# Altium schematic sheet TConsoleWindow.SchDoc: LiveDesign Evaluation - Countdown
size A3; Organization: Altium Limited; Address1: L3, 12a Rodborough Rd; Address2: Frenchs Forest; Address3: NSW; Address4: Australia 2086; DocumentNumber: 8; SheetNumber: 8; SheetTotal: 11
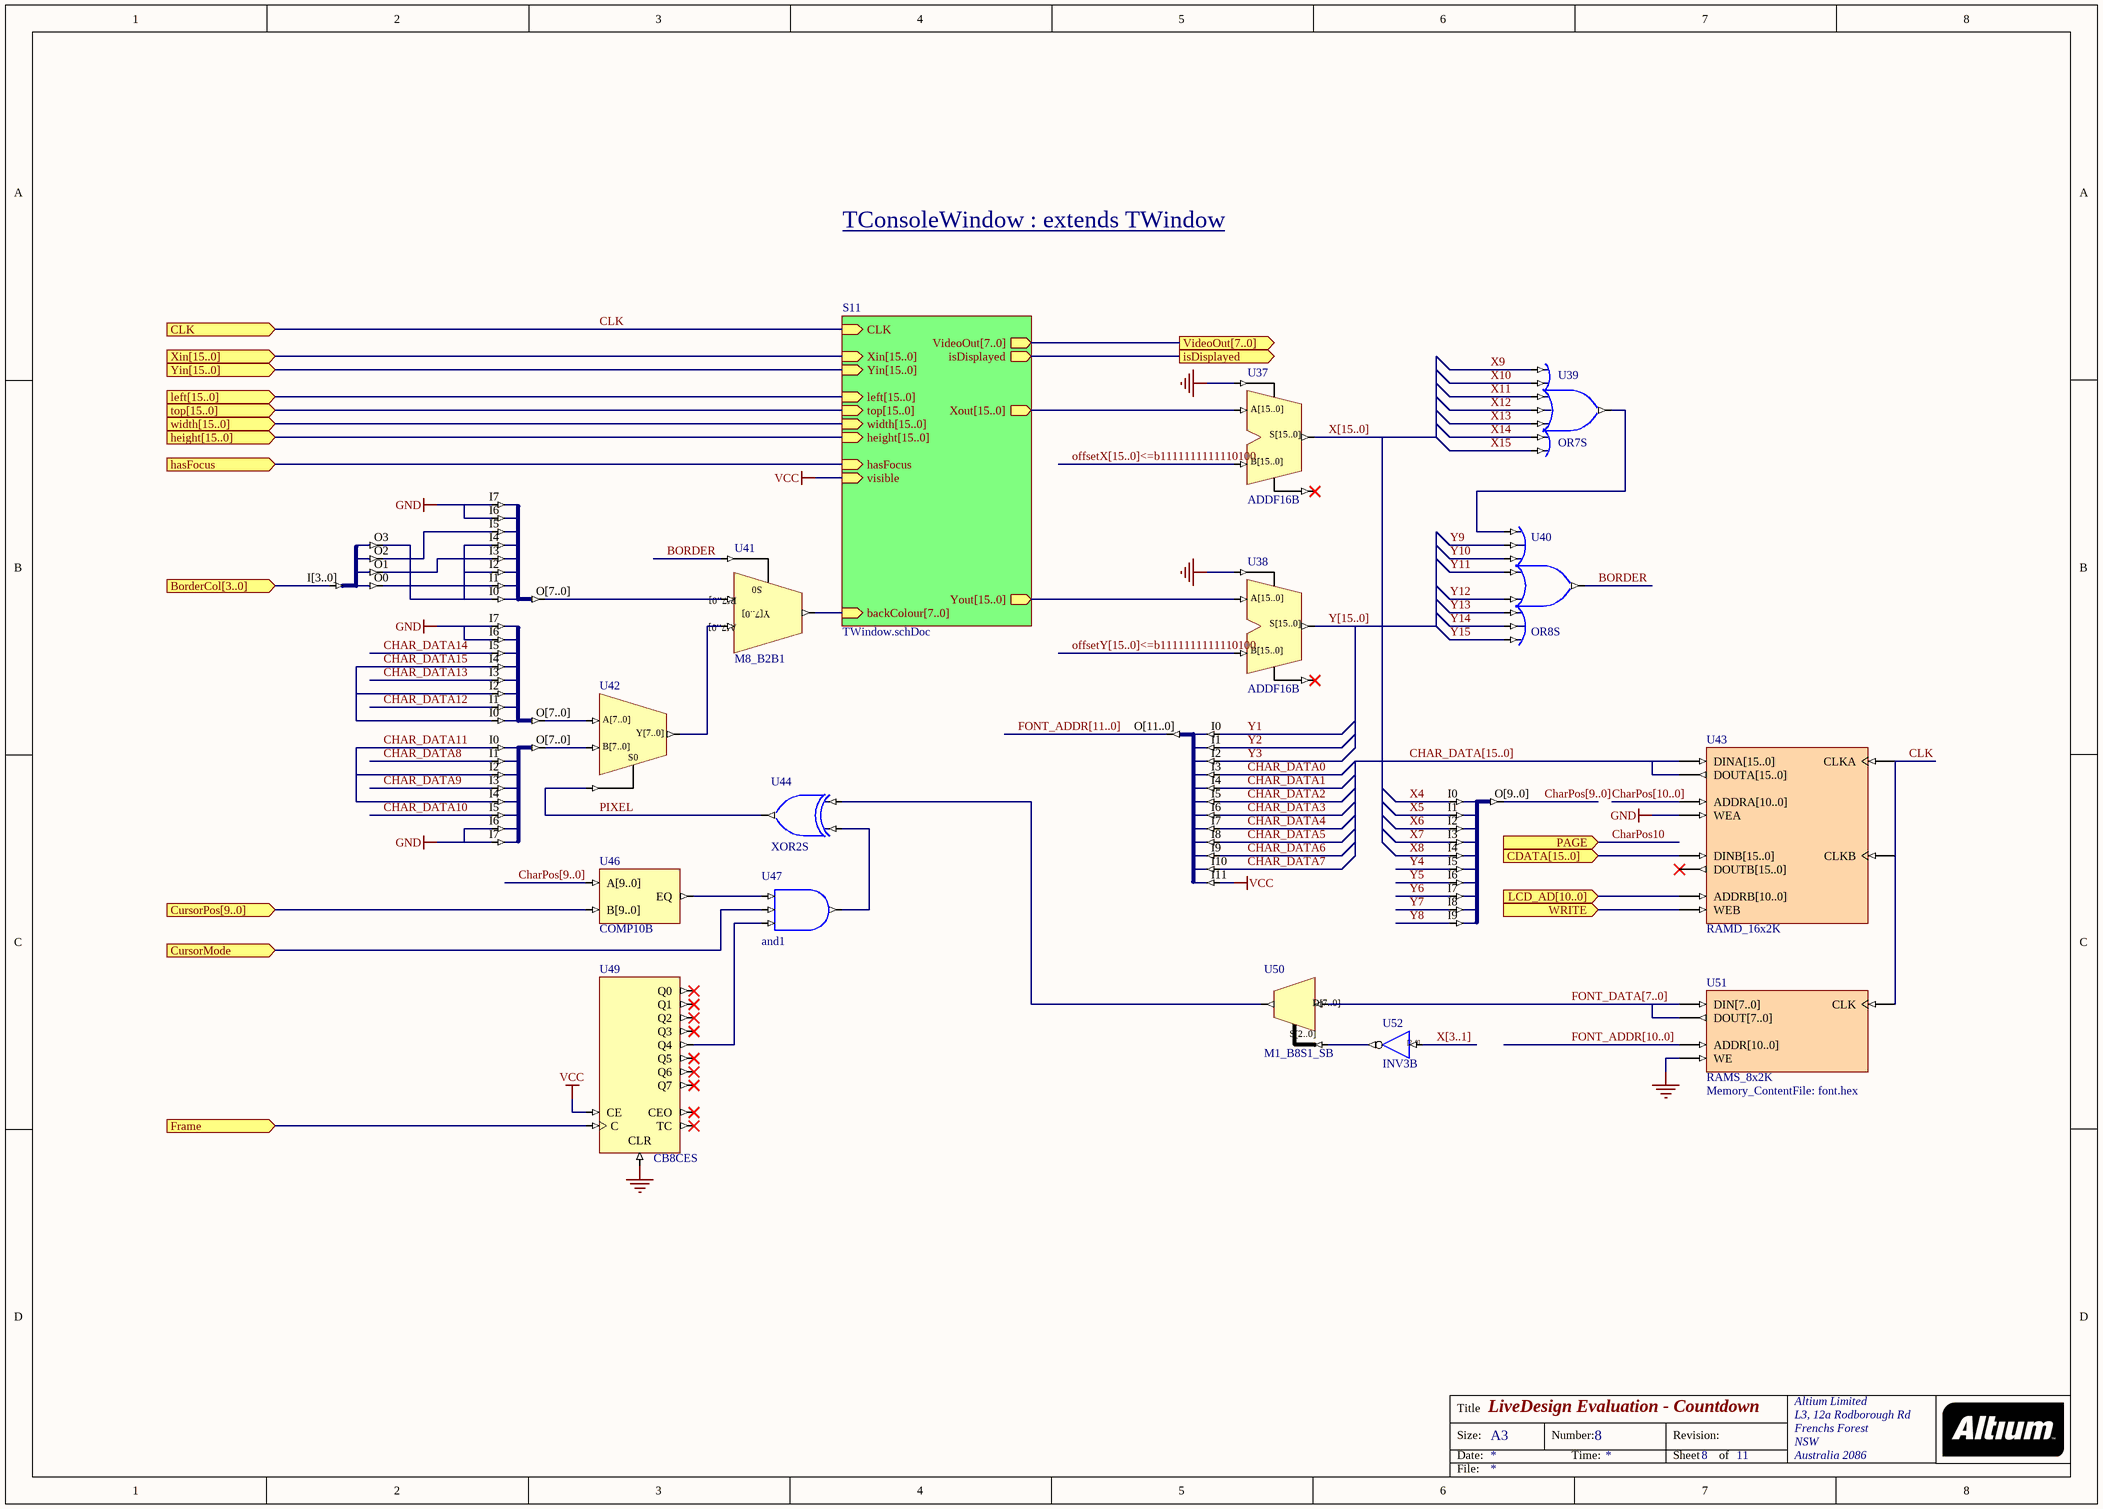
[diagram p0: TConsoleWindow.SchDoc]

## Parts
U33  J8S_8B  (value not drawn)
U34  J8S_8B  (value not drawn)
U35  J8S_8B  (value not drawn)
U36  J4B_4S  (value not drawn)
U37  ADDF16B
U38  ADDF16B
U39  OR7S
U40  OR8S
U41  M8_B2B1
U42  M8_B2B1  (value not drawn)
U43  RAMD_16x2K
U44  XOR2S
U45  J10S_10B  (value not drawn)
U46  COMP10B
U47  and1
U48  J12S_12B  (value not drawn)
U49  CB8CES
U50  M1_B8S1_SB
U51  RAMS_8x2K  Memory_ContentFile: font.hex
U52  INV3B

## Sub-sheets
S11 = TWindow.schDoc: CLK (in), VideoOut[7..0] (out), Xin[15..0] (in), Yin[15..0] (in), top[15..0] (in), width[15..0] (in), height[15..0] (in), left[15..0] (in), Xout[15..0] (out), Yout[15..0] (out), backColour[7..0] (in), isDisplayed (out), visible (in), hasFocus (in)

## Ports
BorderCol[3..0] (in), CDATA[15..0] (in), CLK (in), CursorMode (in), CursorPos[9..0] (in), Frame (in), hasFocus (in), height[15..0] (in), isDisplayed (out), LCD_AD[10..0] (in), left[15..0] (in), PAGE (in), top[15..0] (in), VideoOut[7..0] (out), width[15..0] (in), WRITE (in), Xin[15..0] (in), Yin[15..0] (in)

## Nets
GND: U33.I6 U33.I7 U34.I6 U34.I7 U35.I6 U35.I7 U37.CI U38.CI U43.WEA U49.CLR U51.WE
VCC: U48.I11 U49.CE ; sheet S11/visible
BORDER: U40.O U41.S0
BorderCol[3..0]: U36.I[3..0] ; port BorderCol[3..0]
CDATA[15..0]: U43.DINB[15..0] ; port CDATA[15..0]
CHAR_DATA0: U48.I3
CHAR_DATA1: U48.I4
CHAR_DATA2: U48.I5
CHAR_DATA3: U48.I6
CHAR_DATA4: U48.I7
CHAR_DATA5: U48.I8
CHAR_DATA6: U48.I9
CHAR_DATA7: U48.I10
CHAR_DATA8: U35.I1
CHAR_DATA9: U35.I3
CHAR_DATA10: U35.I5
CHAR_DATA11: U35.I0 U35.I2 U35.I4
CHAR_DATA12: U34.I1
CHAR_DATA13: U34.I3
CHAR_DATA14: U34.I5
CHAR_DATA15: U34.I0 U34.I2 U34.I4
CHAR_DATA[15..0]: U43.DINA[15..0] U43.DOUTA[15..0]
CharPos10: port PAGE
CharPos[9..0]: U45.O[9..0] U46.A[9..0]
CharPos[10..0]: U43.ADDRA[10..0]
CLK: U43.CLKA U43.CLKB U51.CLK ; port CLK, sheet S11/CLK
CursorMode: U47.I1 ; port CursorMode
CursorPos[9..0]: U46.B[9..0] ; port CursorPos[9..0]
FONT_ADDR[10..0]: U51.ADDR[10..0]
FONT_ADDR[11..0]: U48.O[11..0]
FONT_DATA[7..0]: U50.D[7..0] U51.DIN[7..0] U51.DOUT[7..0]
Frame: U49.C ; port Frame
hasFocus: port hasFocus, sheet S11/hasFocus
isDisplayed: port isDisplayed, sheet S11/isDisplayed
LCD_AD[10..0]: U43.ADDRB[10..0] ; port LCD_AD[10..0]
offsetX[15..0]<=b1111111111110100: U37.B[15..0]
offsetY[15..0]<=b1111111111110100: U38.B[15..0]
PIXEL: U42.S0 U44.O
WRITE: U43.WEB ; port WRITE
X4: U45.I0
X5: U45.I1
X6: U45.I2
X7: U45.I3
X8: U45.I4
X9: U39.I0
X10: U39.I1
X11: U39.I2
X12: U39.I3
X13: U39.I4
X14: U39.I5
X15: U39.I6
X[3..1]: U52.I[2..0]
X[15..0]: U37.S[15..0]
Y1: U48.I0
Y2: U48.I1
Y3: U48.I2
Y4: U45.I5
Y5: U45.I6
Y6: U45.I7
Y7: U45.I8
Y8: U45.I9
Y9: U40.I1
Y10: U40.I2
Y11: U40.I3
Y12: U40.I4
Y13: U40.I5
Y14: U40.I6
Y15: U40.I7
Y[15..0]: U38.S[15..0]
NetU33_I0: U33.I0 U33.I2 U33.I4 U36.O3
NetU33_I1: U33.I1 U36.O0
NetU33_I3: U33.I3 U36.O1
NetU33_I5: U33.I5 U36.O2
NetU33_O[7..0]: U33.O[7..0] U41.B[7..0]
NetU34_O[7..0]: U34.O[7..0] U42.A[7..0]
NetU35_O[7..0]: U35.O[7..0] U42.B[7..0]
NetU37_A[15..0]: U37.A[15..0] ; sheet S11/Xout[15..0]
NetU38_A[15..0]: U38.A[15..0] ; sheet S11/Yout[15..0]
NetU39_O: U39.O U40.I0
NetU41_A[7..0]: U41.A[7..0] U42.Y[7..0]
NetU41_Y[7..0]: U41.Y[7..0] ; sheet S11/backColour[7..0]
NetU44_I0: U44.I0 U50.O
NetU44_I1: U44.I1 U47.O
NetU46_EQ: U46.EQ U47.I0
NetU47_I2: U47.I2 U49.Q4
NetU50_S[2..0]: U50.S[2..0] U52.O[2..0]

Not connected (* = marked no-connect by the designer): U37 CO*; U38 CO*; U43 DOUTB[15..0]*; U49 CEO* Q0* Q1* Q2* Q3* Q5* Q6* Q7* TC*

## Buses and harness runs
bus CHAR_DATA[15..0]
bus CharPos[9..0]
bus CharPos[10..0]
bus FONT_ADDR[10..0]
bus FONT_ADDR[11..0]
bus FONT_DATA[7..0]
bus offsetX[15..0]<=b1111111111110100
bus offsetY[15..0]<=b1111111111110100
bus port height[15..0] = sheet S11/height[15..0]
bus port left[15..0] = sheet S11/left[15..0]
bus port top[15..0] = sheet S11/top[15..0]
bus port VideoOut[7..0] = sheet S11/VideoOut[7..0]
bus port width[15..0] = sheet S11/width[15..0]
bus port Xin[15..0] = sheet S11/Xin[15..0]
bus port Yin[15..0] = sheet S11/Yin[15..0]
bus X[3..1]
bus X[15..0]
bus Y[15..0]

## Notes on the sheet
- TConsoleWindow : extends TWindow
- Title
- Size:
- Date:
- A3
- Number:
- Time:
- Revision:
- Sheet
- of
- File:
- (in symbol INV3B) [2..0]

## Library data of the parts
U33-U35 = J8S_8B: 8 Single pin inputs to single 8-Bit output bus; ArchiveName: GENERIC; VHDLIB_SIM: GENERIC_LIB; Published: 29-Jan-2004; Publisher: Altium Limited; Core Revision: 1.00.00
U36 = J4B_4S: 4-Bit input bus to 4 Single pin outputs; ArchiveName: GENERIC; VHDLIB_SIM: GENERIC_LIB; Published: 29-Jan-2004; Publisher: Altium Limited; Core Revision: 1.00.00
U37 U38 = ADDF16B: 16-Bit Cascadable Unsigned Binary Full Adder, Bus Version; ArchiveName: GENERIC; VHDLIB_SIM: GENERIC_LIB; Published: 31-May-2004; Publisher: Altium Limited; Core Revision: 1.00.00
U39 = OR7S: 7-Input OR Gate, Single Pin Version; Xilinx Equivalent: OR7; ArchiveName: GENERIC; VHDLIB_SIM: GENERIC_LIB; Published: 29-Jan-2004; Publisher: Altium Limited; Core Revision: 1.00.00
U40 = OR8S: 8-Input OR Gate, Single Pin Version; ArchiveName: GENERIC; VHDLIB_SIM: GENERIC_LIB; Xilinx Equivalent: OR8; Published: 29-Jan-2004; Publisher: Altium Limited; Core Revision: 1.00.00
U41 U42 = M8_B2B1: 2x8-Bit Bus to 1x8-Bit Bus Multiplexer; ArchiveName: GENERIC; VHDLIB_SIM: GENERIC_LIB; Published: 29-Jan-2004; Publisher: Altium Limited; Core Revision: 1.00.00
U43 = RAMD_16x2K: Dual Port RAM; Memory_DepthA: 2048; Memory_Type: RAM_DualPortBlock; Memory_WidthA: 16; Memory_ClockEdge: Rising; Nexus_Core: Memory_Program; Memory_EnablePin: False; Published: 23/04/2004; Publisher: Altium Hobart Technology Center; Memory_DepthB: 2048; Memory_WidthB: 16
U44 = XOR2S: 2-Input Exclusive-OR Gate, Single Pin Version; ArchiveName: GENERIC; VHDLIB_SIM: GENERIC_LIB; Xilinx Equivalent: XOR2; Published: 29-Jan-2004; Publisher: Altium Limited; Core Revision: 1.00.00
U45 = J10S_10B: 10 Single pin inputs to single 10-Bit output bus; ArchiveName: GENERIC; VHDLIB_SIM: GENERIC_LIB; Published: 29-Jan-2004; Publisher: Altium Limited; Core Revision: 1.00.00
U46 = COMP10B: 10-Bit Identity Comparator, Bus Version; ArchiveName: GENERIC; VHDLIB_SIM: GENERIC_LIB; Published: 29-Jan-2004; Publisher: Altium Limited; Core Revision: 1.00.00
U47 = AND3S: 3-Input AND Gate, Single Pin Version; ArchiveName: GENERIC; VHDLIB_SIM: GENERIC_LIB; Xilinx Equivalent: AND3; Published: 29-Jan-2004; Publisher: Altium Limited; Core Revision: 1.00.00
U48 = J12S_12B: 12 Single pin inputs to single 12-Bit output bus; ArchiveName: GENERIC; VHDLIB_SIM: GENERIC_LIB; Published: 29-Jan-2004; Publisher: Altium Limited; Core Revision: 1.00.00
U49 = CB8CES: 8-Bit Cascadable Binary Counters with Clock Enable and Asynchronous Clear, Single Pin Version; ArchiveName: GENERIC; VHDLIB_SIM: GENERIC_LIB; Published: 29-Jan-2004; Publisher: Altium Limited; Core Revision: 1.00.00
U50 = M1_B8S1_SB: 1x8-Bit Bus to 1x1-Single Wire Multiplexer With Bus Version Select; ArchiveName: GENERIC; VHDLIB_SIM: GENERIC_LIB; Published: 31-May-2004; Publisher: Altium Limited; Core Revision: 1.00.00
U51 = RAMS_8x2K: Single Port RAM; Memory_Type: RAM_SinglePortBlock; Memory_ClockEdge: Rising; Nexus_Core: Memory_Program; Memory_Depth: 2048; Memory_Width: 8; Memory_EnablePin: False; Published: 23/04/2004; Publisher: Altium Hobart Technology Center
U52 = INV3B: 3-Bit Inverter, Bus Version; ArchiveName: GENERIC; VHDLIB_SIM: GENERIC_LIB; Published: 29-Jan-2004; Publisher: Altium Limited; Core Revision: 1.00.00